# EAGLE design fabftdi-tiny45x (EAGLE 8.2.2)
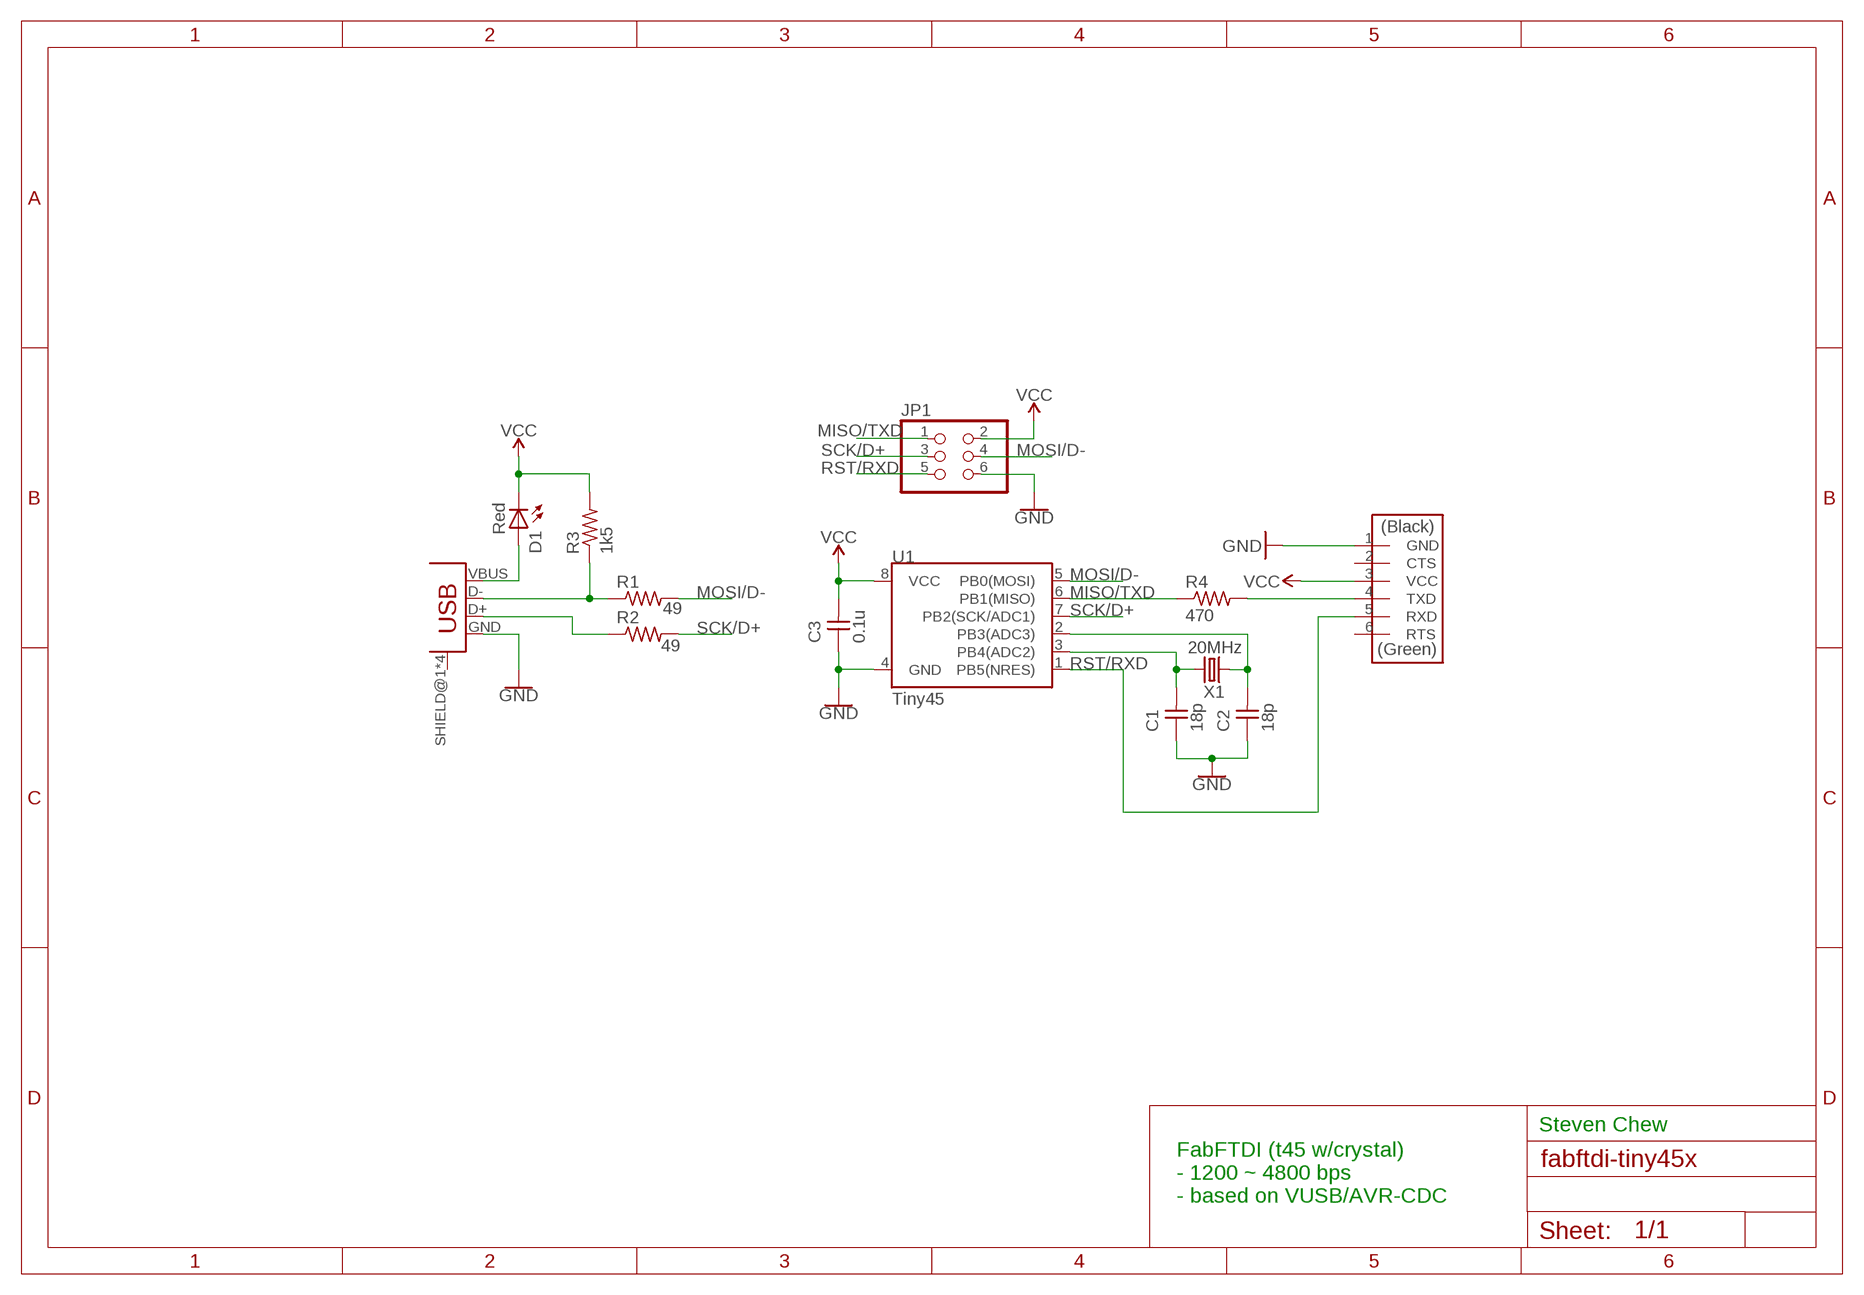
[diagram p0: schematic, sheet 1]

## Parts
C1  18p  CAP-UNPOLARIZEDFAB  [C1206FAB]
C2  18p  CAP-UNPOLARIZEDFAB  [C1206FAB]
C3  0.1u  CAP-UNPOLARIZEDFAB  [C1206FAB]
D1  Red  LEDFAB1206  [LED1206FAB]
JP1  PINHD-2X3-SMDFAB  [2X03SMD-FAB]
JP2  FTDI-SMD-HEADER  [1X06SMD]
R1  49  RES-US1206FAB  [R1206FAB]
R2  49  RES-US1206FAB  [R1206FAB]
R3  1k5  RES-US1206FAB  [R1206FAB]
R4  470  RES-US1206FAB  [R1206FAB]
U1  Tiny45  ATTINY85TINY45-20-SMT  [SO08-EIAJ]
U2  USB_MINI  [USB_MINI]
X1  20MHz  CRYSTAL  [2-SMD-5X3MM]

## Nets
GND: C1.1 C2.1 C3.1 JP1.6 JP2.1(GND) U1.4(GND) U2.GND
MISO/TXD: JP1.1 R4.1 U1.6(PB1(MISO))
MOSI/D-: JP1.4 R1.2 U1.5(PB0(MOSI))
N$1: R1.1 R3.1 U2.D-
N$2: R2.1 U2.D+
N$4: D1.1(A) U2.VBUS
N$11: C1.2 U1.3(PB4(ADC2)) X1.P$2
N$12: C2.2 U1.2(PB3(ADC3)) X1.P$1
N$14: JP2.4(TXD) R4.2
RST/RXD: JP1.5 JP2.5(RXD) U1.1(PB5(NRES))
SCK/D+: JP1.3 R2.2 U1.7(PB2(SCK/ADC1))
VCC: C3.2 D1.2(C) JP1.2 JP2.3(VCC) R3.2 U1.8(VCC)
Unconnected: JP2.2(CTS) JP2.6(RTS) U2.SHIELD@1(SHIELD) U2.SHIELD@2(SHIELD) U2.SHIELD@3(SHIELD) U2.SHIELD@4(SHIELD)

## Notes on the sheet
- Steven Chew
- FabFTDI (t45 w/crystal)
  - 1200 ~ 4800 bps
  - based on VUSB/AVR-CDC

## Library data of the parts
C1-C3 = 00fab:CAP-UNPOLARIZED
D1 = 00fab:LED: LED
JP1 = 00fab:PINHD-2X3-SMD: PIN HEADER
JP2 = 00fab:FTDI-SMD-HEADER
R1-R4 = 00fab:RES-US: Resistor (US Symbol) Variants with postfix FAB are widened to allow the routing of internal traces
U1 = 00fab:ATTINY85: Atmel 8-pin 2/4/8kB flash uC; PROD_ID: IC-08922; VALUE: Tiny45-20-SMT
U2 = 00fab:USB_MINI
X1 = 00fab:CRYSTAL

## Board
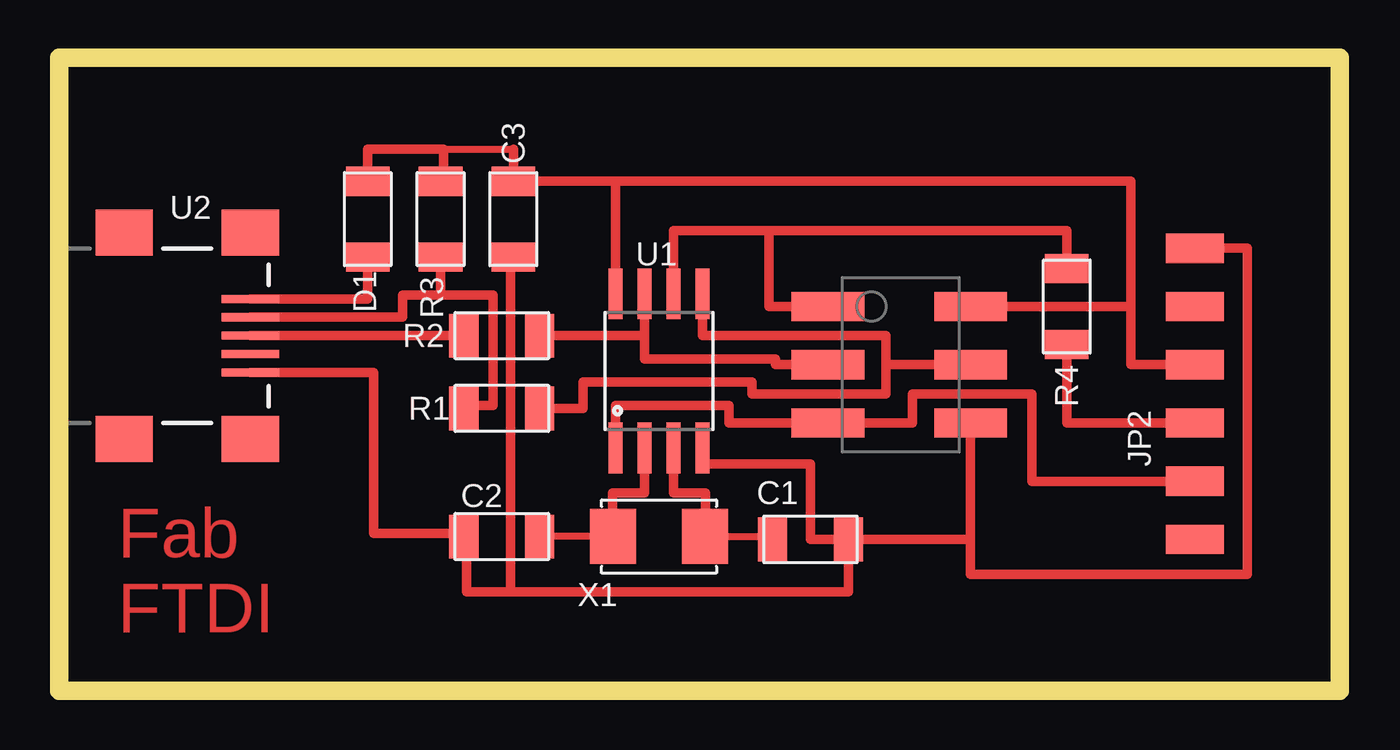
[diagram p1: board, top side]

Size 55.86 x 27.61 mm. Coordinates in mm from the lower left corner, seen from the top.
Outline: 0,0 55.86,0 55.86,27.61 0,27.61 0,0
Copper layers (1*16): Top 0.035mm / dielectric 1.5mm / Bottom 0.035mm
Design rules "default *": minimum track width 6mil, minimum drill 0.35mm, track to track 12mil, track to pad 12mil, pad to pad 12mil, via to via 6mil, smd to smd 8mil, copper to edge 40mil, drill to drill 6mil, minimum pad ring 10mil, minimum via ring 8mil, stop-mask expansion 4mil, vias tented up to drill 0mil, thermal gap 10mil

### Footprints (pad centres in the part's own frame; a part is rotated, then mirrored left to right if it is on the bottom)
C1206FAB = smd 1.27 x 1.905: 1 -1.651,0; 2 1.651,0
LED1206FAB = smd 1.27 x 1.905: 1 -1.651,0; 2 1.651,0
2X03SMD-FAB = smd 3.175 x 1.27: 1 -2.794,2.54; 2 3.429,2.54; 3 -2.794,0; 4 3.429,0; 5 -2.794,-2.54; 6 3.429,-2.54
1X06SMD = smd 2.54 x 1.27: 1 0,6.35; 2 0,3.81; 3 0,1.27; 4 0,-1.27; 5 0,-3.81; 6 0,-6.35
R1206FAB = smd 1.27 x 1.905: 1 -1.651,0; 2 1.651,0
SO08-EIAJ = smd 0.61 x 2.21: 1 -1.905,-3.378; 2 -0.635,-3.378; 3 0.635,-3.378; 4 1.905,-3.378; 5 1.905,3.353; 6 0.635,3.353; 7 -0.635,3.353; 8 -1.905,3.353
USB_MINI = smd 2.5 x 0.35: D+ 3.77,0; D- 3.77,0.8; GND 3.77,-1.6; ID 3.77,-0.8; VBUS 3.77,1.6 | smd 2.5 x 2: SHIELD@1 -1.73,-4.5; SHIELD@2 -1.73,4.5; SHIELD@3 3.77,4.5; SHIELD@4 3.77,-4.5
2-SMD-5X3MM = smd 2 x 2.4: P$1 -2,0; P$2 2,0

### Placement (x,y rotation side)
C1  32.77,6.6 180 top
C2  19.3,6.73 0 top
C3  19.81,20.57 90 top
D1  13.46,20.57 90 top
JP1  36.32,14.22 0 top
JP2  49.53,12.95 0 top
R1  19.3,12.32 0 top
R2  19.3,15.49 0 top
R3  16.64,20.57 90 top
R4  43.94,16.76 270 top
U1  26.16,13.97 0 top
U2  4.57,15.49 0 top
X1  26.16,6.73 0 top

### Tracks (layer width: path | path; a pad name or v marks a point on that pad's centre or on a via)
GND
  Top 0.305: 17.65,6.86 C2.1 17.78,6.73 | 28.07,9.91 U1.4 | C3.1 19.7,18.92
  Top 0.406: 17.65,6.86 13.72,6.86 13.72,13.89 U2.GND | 17.78,6.73 17.78,4.32 19.7,4.32 | C1.1 32.77,6.6 32.77,9.91 28.07,9.91 | 19.7,18.92 19.7,4.32 | C1.1 39.75,6.6 | 39.75,6.6 39.75,5.08 51.82,5.08 51.82,19.3 JP2.1 | 39.75,6.6 JP1.6 | 19.7,4.32 34.42,4.32 C1.1
MISO/TXD
  Top 0.406: R4.1 43.94,20.07 30.95,20.07 | 30.95,20.07 26.8,20.07 U1.6 | JP1.1 30.95,16.76 30.95,20.07
MOSI/D-
  Top 0.406: 36.07,14.22 JP1.4 | 36.07,14.22 36.07,15.49 28.07,15.49 U1.5 | R1.2 22.86,12.32 22.86,13.46 30.23,13.46 30.23,12.95 36.07,12.95 36.07,14.22
N$1
  Top 0.305: 17.65,12.45 R1.1
  Top 0.406: U2.D- 14.99,16.29 14.99,17.27 16.64,17.27 | 16.64,17.27 R3.1 | 16.64,17.27 18.92,17.27 18.92,12.45 17.65,12.45
N$2
  Top 0.406: R2.1 U2.D+
N$3
  Top 0.076: 0,0 55.88,0 55.88,27.56 0,27.56 0,0
N$4
  Top 0.406: U2.VBUS 13.46,17.09 D1.1
N$11
  Top 0.305: 28.19,5.97 X1.P$2 31.11,6.73 C1.2
  Top 0.406: 28.19,5.97 28.19,8.64 26.8,8.64 U1.3
N$12
  Top 0.305: 24.13,5.97 X1.P$1 C2.2
  Top 0.406: 24.13,5.97 24.13,8.64 25.53,8.64 U1.2
N$14
  Top 0.406: R4.2 43.94,11.68 JP2.4
RST/RXD
  Top 0.406: U1.1 24.26,12.45 29.21,12.45 29.21,11.68 JP1.5 37.21,11.68 37.21,12.95 42.42,12.95 42.42,9.14 JP2.5
SCK/D+
  Top 0.406: 25.53,15.79 U1.7 | 25.53,15.79 25.53,15.49 R2.2 | JP1.3 31.24,14.22 31.24,14.48 25.53,14.48 25.53,15.79
VCC
  Top 0.305: 16.77,23.62 19.81,23.62 | R3.2 16.77,22.23
  Top 0.406: D1.2 13.46,23.62 16.77,23.62 16.77,22.23 | 19.81,23.62 C3.2 24.26,22.23 | 24.26,22.23 U1.8 | 46.74,16.76 JP1.2 | 46.74,16.76 46.74,14.22 JP2.3 | 24.26,22.23 46.74,22.23 46.74,16.76

### Text on the board
Top: Fab / FTDI